# EasyEDA Pro project ProPrj_universal-fpga-expansion-board_2026-01-11.epro

# Schematic Schematic1
Board Name: Board1; Create Date: 2025-07-10; Page Name: P1; Project Name: FPGA_LAB; Schematic Name: Schematic1; Update Date: 2025-07-13; Company: EasyEDA.com; Page Size: A4; Version: V1.0
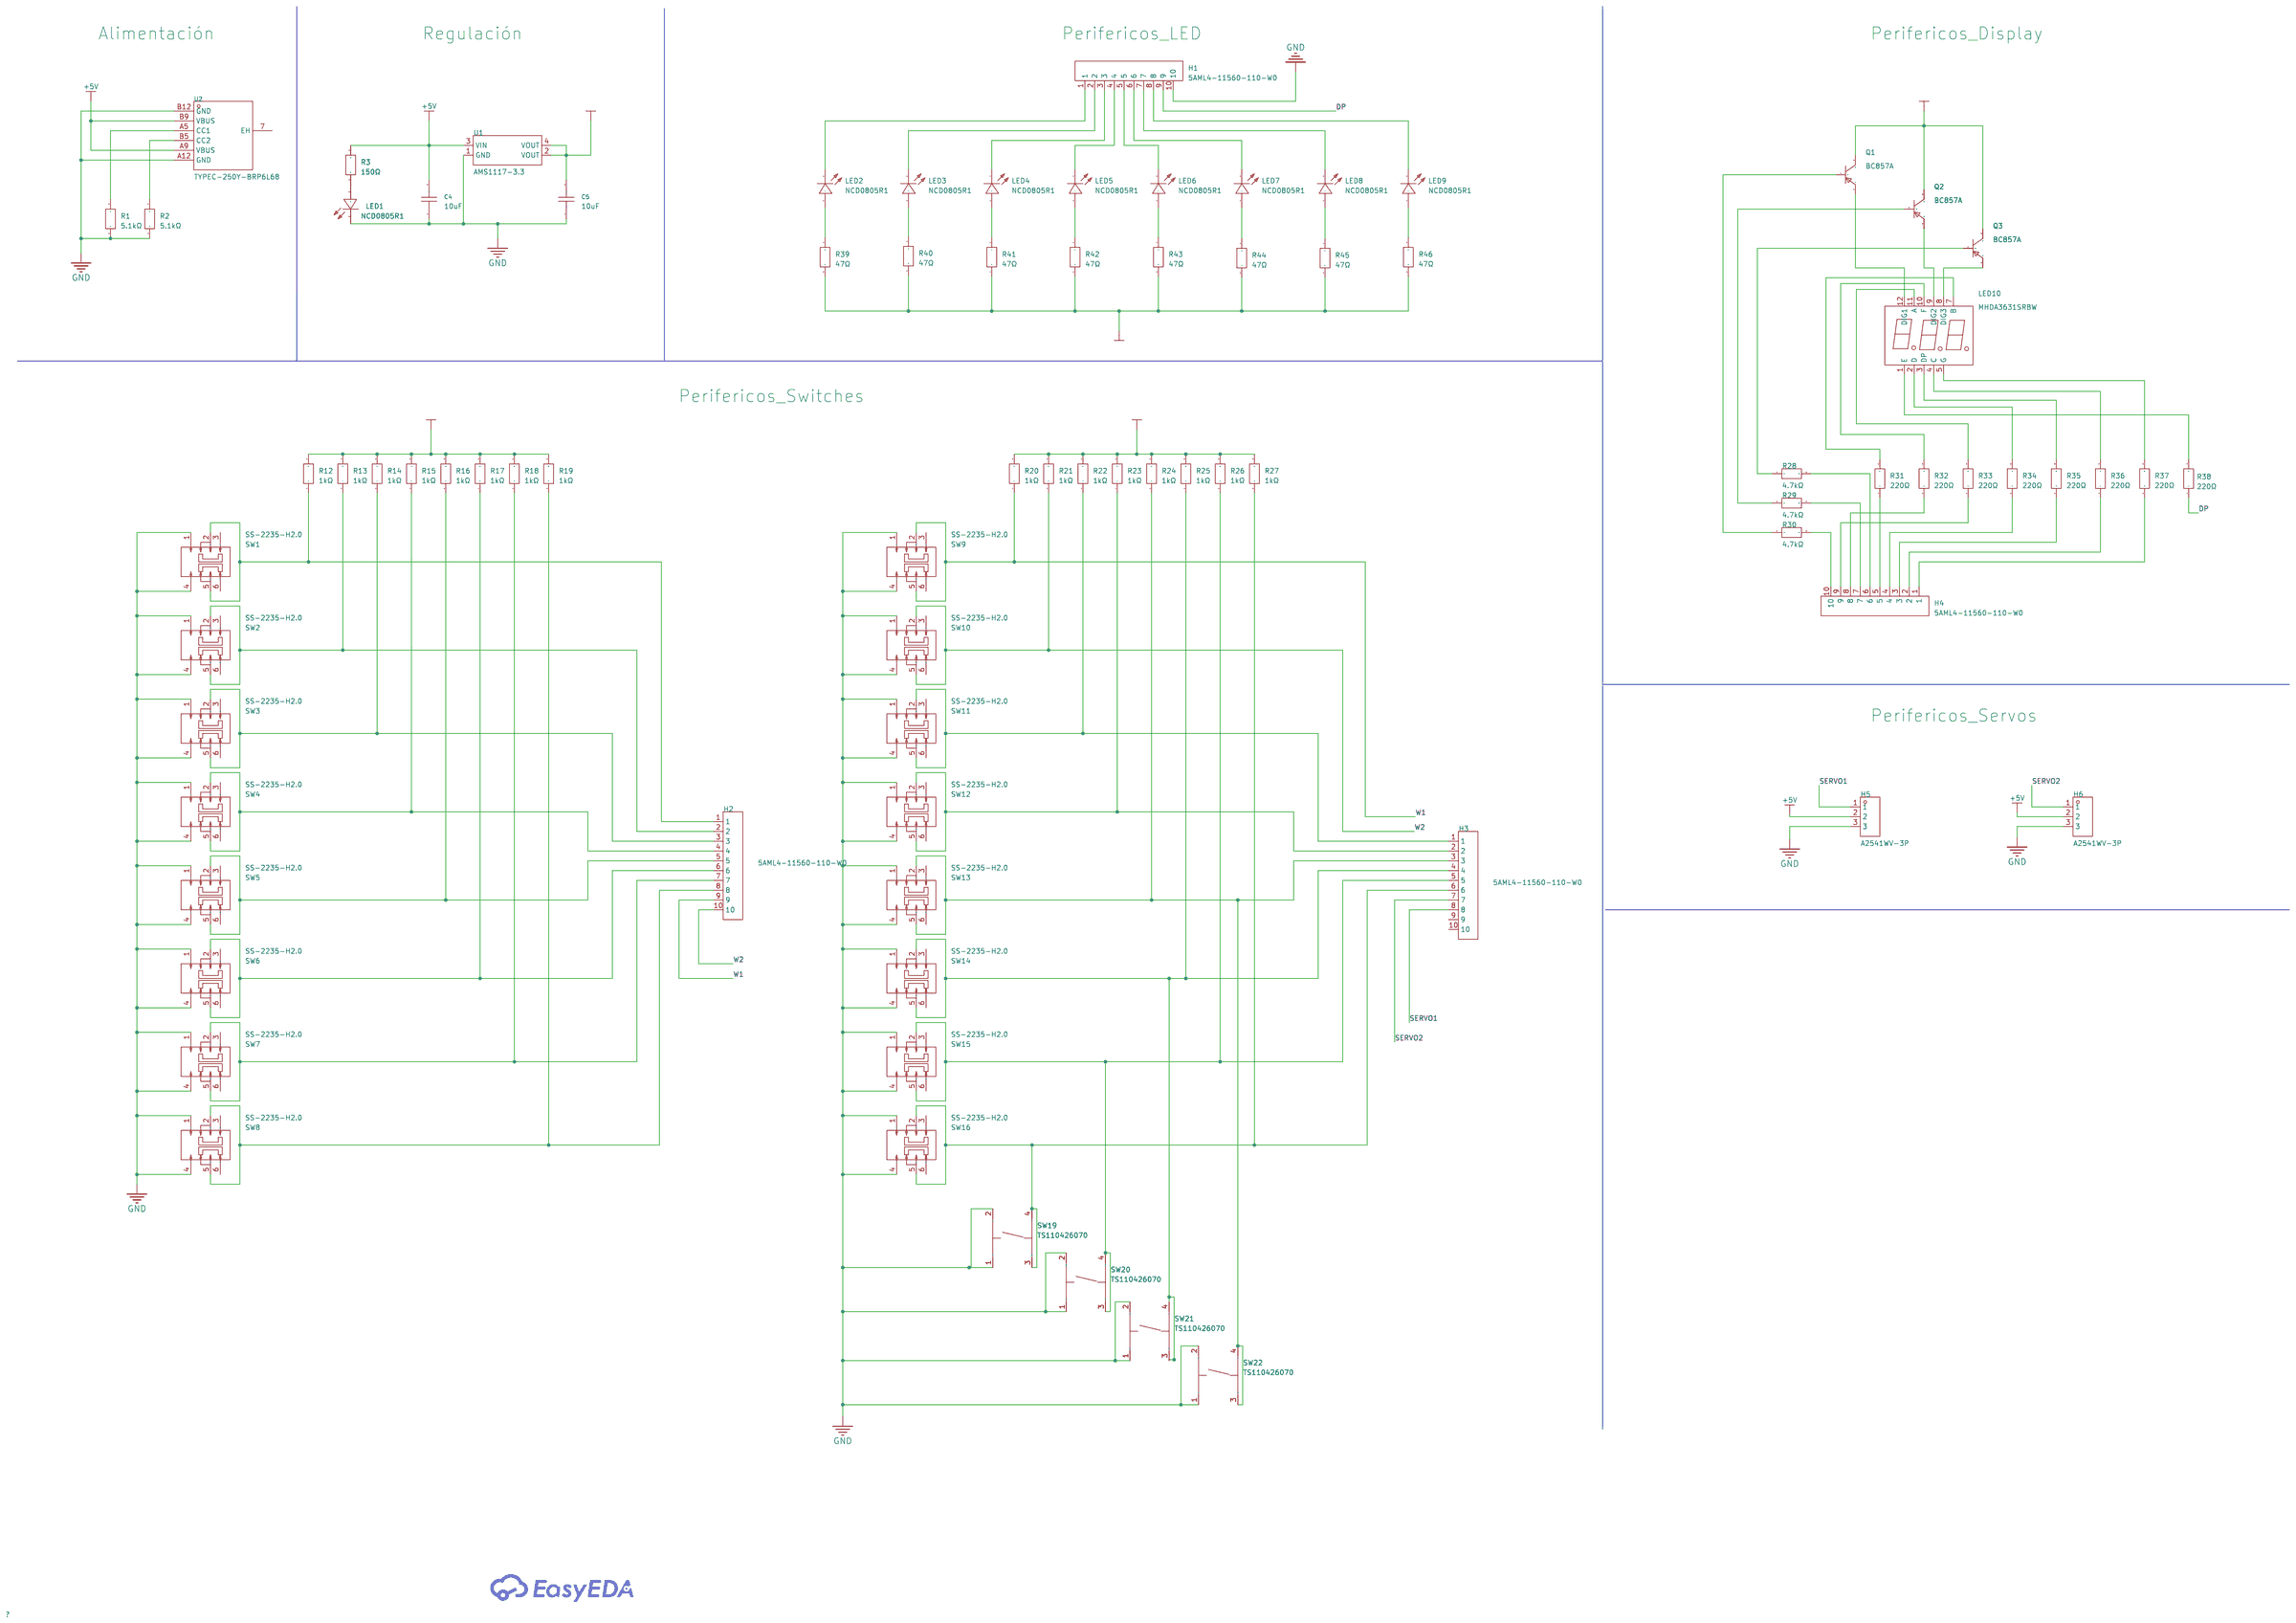
[diagram p0: schematic sheet]

## Parts
C4  10uF  [C0603]
C5  10uF  [C0603]
H1  5AML4-11560-110-W0  [HDR-TH_10P-P2.54-V-M-1]
H2  5AML4-11560-110-W0  [HDR-TH_10P-P2.54-V-M-1]
H3  5AML4-11560-110-W0  [HDR-TH_10P-P2.54-V-M-1]
H4  5AML4-11560-110-W0  [HDR-TH_10P-P2.54-V-M-1]
H5  A2541WV-3P  [HDR-TH_3P-P2.54-V-M]
H6  A2541WV-3P  [HDR-TH_3P-P2.54-V-M]
LED1  NCD0805R1  [LED0805-R-RD]
LED2  NCD0805R1  [LED0805-R-RD]
LED3  NCD0805R1  [LED0805-R-RD]
LED4  NCD0805R1  [LED0805-R-RD]
LED5  NCD0805R1  [LED0805-R-RD]
LED6  NCD0805R1  [LED0805-R-RD]
LED7  NCD0805R1  [LED0805-R-RD]
LED8  NCD0805R1  [LED0805-R-RD]
LED9  NCD0805R1  [LED0805-R-RD]
LED10  MHDA3631SRBW  [LED-SEG-TH_11P-L22.5-W14.0-P2.54-S10.18-BL]
Q1  BC857A  [SOT-23-3_L3.0-W1.7-P0.95-LS2.9-BR]
Q2  BC857A  [SOT-23-3_L3.0-W1.7-P0.95-LS2.9-BR]
Q3  BC857A  [SOT-23-3_L3.0-W1.7-P0.95-LS2.9-BR]
R1  5.1kΩ  [R1206]
R2  5.1kΩ  [R1206]
R3  150Ω  [R1206]
R12  1kΩ  [R1206]
R13  1kΩ  [R1206]
R14  1kΩ  [R1206]
R15  1kΩ  [R1206]
R16  1kΩ  [R1206]
R17  1kΩ  [R1206]
R18  1kΩ  [R1206]
R19  1kΩ  [R1206]
R20  1kΩ  [R1206]
R21  1kΩ  [R1206]
R22  1kΩ  [R1206]
R23  1kΩ  [R1206]
R24  1kΩ  [R1206]
R25  1kΩ  [R1206]
R26  1kΩ  [R1206]
R27  1kΩ  [R1206]
R28  4.7kΩ  [R1206]
R29  4.7kΩ  [R1206]
R30  4.7kΩ  [R1206]
R31  220Ω  [R1206]
R32  220Ω  [R1206]
R33  220Ω  [R1206]
R34  220Ω  [R1206]
R35  220Ω  [R1206]
R36  220Ω  [R1206]
R37  220Ω  [R1206]
R38  220Ω  [R1206]
R39  47Ω  [R1206]
R40  47Ω  [R1206]
R41  47Ω  [R1206]
R42  47Ω  [R1206]
R43  47Ω  [R1206]
R44  47Ω  [R1206]
R45  47Ω  [R1206]
R46  47Ω  [R1206]
SW1  SS-2235-H2.0  [SW-TH_6P-L9.0-W3.6-P2.50_SS-2235-H2.0]
SW2  SS-2235-H2.0  [SW-TH_6P-L9.0-W3.6-P2.50_SS-2235-H2.0]
SW3  SS-2235-H2.0  [SW-TH_6P-L9.0-W3.6-P2.50_SS-2235-H2.0]
SW4  SS-2235-H2.0  [SW-TH_6P-L9.0-W3.6-P2.50_SS-2235-H2.0]
SW5  SS-2235-H2.0  [SW-TH_6P-L9.0-W3.6-P2.50_SS-2235-H2.0]
SW6  SS-2235-H2.0  [SW-TH_6P-L9.0-W3.6-P2.50_SS-2235-H2.0]
SW7  SS-2235-H2.0  [SW-TH_6P-L9.0-W3.6-P2.50_SS-2235-H2.0]
SW8  SS-2235-H2.0  [SW-TH_6P-L9.0-W3.6-P2.50_SS-2235-H2.0]
SW9  SS-2235-H2.0  [SW-TH_6P-L9.0-W3.6-P2.50_SS-2235-H2.0]
SW10  SS-2235-H2.0  [SW-TH_6P-L9.0-W3.6-P2.50_SS-2235-H2.0]
SW11  SS-2235-H2.0  [SW-TH_6P-L9.0-W3.6-P2.50_SS-2235-H2.0]
SW12  SS-2235-H2.0  [SW-TH_6P-L9.0-W3.6-P2.50_SS-2235-H2.0]
SW13  SS-2235-H2.0  [SW-TH_6P-L9.0-W3.6-P2.50_SS-2235-H2.0]
SW14  SS-2235-H2.0  [SW-TH_6P-L9.0-W3.6-P2.50_SS-2235-H2.0]
SW15  SS-2235-H2.0  [SW-TH_6P-L9.0-W3.6-P2.50_SS-2235-H2.0]
SW16  SS-2235-H2.0  [SW-TH_6P-L9.0-W3.6-P2.50_SS-2235-H2.0]
SW19  TS110426070  [SW-SMD_TS110426070]
SW20  TS110426070  [SW-SMD_TS110426070]
SW21  TS110426070  [SW-SMD_TS110426070]
SW22  TS110426070  [SW-SMD_TS110426070]
U1  AMS1117-3.3  [SOT-223-3_L6.7-W3.7-P2.30-LS7.0-BR]
U2  TYPEC-250Y-BRP6L68  [TYPE-C-SMD_XUNPU_TYPEC-250Y-BRP6L68]

## Library data of the parts
C4 C5 = CL10A106MQ8NNNC: Capacitance: Tolerance:±20% Tolerance:±20% Voltage Rated: Temperature Coefficient:; LCSC Part Name: 10uF ±20% 6.3V; Supplier Part: C1691; Manufacturer: SAMSUNG(三星); Supplier Footprint: 0603; JLCPCB Part Class: Extended Part; Datasheet: https://atta.szlcsc.com/upload/public/pdf/source/20160218/1457707763339.pdf; Supplier: LCSC; Tolerance: ±20%
H1-H4 = 5AML4-11560-110-W0: Pin Structure:1x10P Pitch:2.54mm Row Spacing:- Circluar Pins/Square Pins:Pin Header Mounting Type:Through Hole Number of Rows:1 Number of Pins:10P Current Rating:3A Voltage Rating (Max):- Length of Mating Pin:6mm Insulation Height:2.5mm Length of End Conn; LCSC Part Name: 1x10P 间距:2.54mm 方针 直插; Supplier Part: C41374240; Manufacturer: SAMZO(三佐); Supplier Footprint: 插件,P=2.54mm; Datasheet: https://atta.szlcsc.com/upload/public/pdf/source/20240717/E6C59586925ABF058B406B6757A67FC7.pdf; Supplier: LCSC; Pin Structure: 1x10P; Pitch: 2.54mm; Circluar Pins/Square Pins: Pin Header; Mounting Type: Through Hole; Number of Rows: 1; Number of Pins: 10P; Current Rating: 3A; Length of Mating Pin: 6mm; Insulation Height: 2.5mm; Length of End Connection Pin: 3mm; Contact Material: Brass; Contact Plating: Gold; Operating Temperature: -40℃~+105℃; Color: Black
H5 H6 = A2541WV-3P_C5445396: Pin Structure:1x3P Pitch:2.54mm Row Spacing:- Circluar Pins/Square Pins:Policy Mounting Type:Straight Number of Rows:Single Row Number of Pins:3P Current Rating:3A Voltage Rating (Max):250V Length of Mating Pin:6mm Insulation Height:2.54mm Length of End C; LCSC Part Name: 1x3P 间距:2.54mm 方针 直插; Supplier Part: C5445396; Manufacturer: CJT(长江连接器); Supplier Footprint: 插件,P=2.54mm; JLCPCB Part Class: Extended Part; Datasheet: https://atta.szlcsc.com/upload/public/pdf/source/20190522/C339348_148DC62DFEE35B66DE27661541078F4A.pdf; Supplier: LCSC; Pin Structure: 1x3P; Pitch: 2.54mm; Circluar Pins/Square Pins: Policy; Mounting Type: Straight; Number of Rows: Single Row; Number of Pins: 3P; Current Rating: 3A; Voltage Rating (Max): 250V; Length of Mating Pin: 6mm; Insulation Height: 2.54mm; Length of End Connection Pin: 3mm; Contact Material: Brass; Contact Plating: Gold; Operating Temperature: -40℃~+105℃; Color: Black
LED1-LED9 = NCD0805R1_C84256: Lamp Holder Type:- Emitted Color:Red Forward Voltage (VF):1.6V~2.6V Forward Voltage (VF):1.6V~2.6V Power Dissipation:65mW Forward Current:20mA Dominant Wavelength:615nm~630nm Dominant Wavelength:615nm~630nm Peak Wavelength:- Diode Configuration:独立二极管 Lens; Supplier Part: C84256; Manufacturer: 国星光电; Supplier Footprint: 0805; JLCPCB Part Class: Basic Part; Datasheet: https://atta.szlcsc.com/upload/public/pdf/source/20200820/C84256_F0A75A43B3EAD75808600A0514C76B99.pdf; Supplier: LCSC; Emitted Color: Red; Forward Voltage (VF): 1.6V~2.6V; Power Dissipation: 65mW; Forward Current: 20mA; Dominant Wavelength: 615nm~630nm; Diode Configuration: 独立二极管; Lens Color: 无色透明透镜; Luminous Intensity: 67mcd~195mcd; Viewing Angle: 130°; Operating Temperature: -30℃~+85℃
LED10 = MHDA3631SRBW: Number of Characters:3Bit Module Size:22.5mmx14mmx7.2mm Power Dissipation:50mW Luminous Color:Red LED Polarity:共阳极 Digit/Alpha Size(inch):0.362; LCSC Part Name: 0.36直插数码管共阳三八红色光; Supplier Part: C401123; Manufacturer: MEIHUA(美华); Supplier Footprint: 插件; JLCPCB Part Class: Extended Part; Datasheet: https://atta.szlcsc.com/upload/public/pdf/source/20190702/C401123_23F92DF2081D881E25360757DABBD4C8.pdf; Supplier: LCSC; Number of Characters: 3Bit; Module Size: 22.5mmx14mmx7.2mm; Power Dissipation: 50mW; Luminous Color: Red; LED Polarity: 共阳极; Digit/Alpha Size(inch): 0.362
Q1-Q3 = BC857A_1: Supplier Part: C19626403; Manufacturer: YFW(佑风微); Supplier Footprint: SOT-23; JLCPCB Part Class: Extended Part; Datasheet: https://atta.szlcsc.com/upload/public/pdf/source/20231208/71E5B256E3A60A36DE87C30A129C1C7C.pdf; Supplier: LCSC
R1 R2 = FRC1206J512 TS: Type:Thick Film Resistors Resistance:5.1kΩ Tolerance:±5% Tolerance:±5% Power(Watts):0.25W Voltage-Supply(Max):200V Temperature Coefficient:±100ppm/℃ Temperature Coefficient:±100ppm/℃ Operating Temperature:-55℃~+155℃ Operating Temperature:-55℃~+155℃; LCSC Part Name: 5.1kΩ ±5% 250mW 厚膜电阻; Supplier Part: C2907509; Manufacturer: FOJAN(富捷); Supplier Footprint: 1206; JLCPCB Part Class: Extended Part; Datasheet: https://atta.szlcsc.com/upload/public/pdf/source/20211221/925EC7D7225764EE0046F22065062C87.pdf; Supplier: LCSC; Type: Thick Film Resistors; Tolerance: ±5%; Power(Watts): 0.25W; Voltage-Supply(Max): 200V; Temperature Coefficient: ±100ppm/℃; Operating Temperature: -55℃~+155℃
R3 = SC1206J1500F8ANRH: Resistance:150Ω Tolerance:±5% Tolerance:±5% Power(Watts):- Temperature Coefficient:±100ppm/℃ Temperature Coefficient:±100ppm/℃; LCSC Part Name: 150Ω ±5%; Supplier Part: C3152296; Manufacturer: Sunway(信维通信); Supplier Footprint: 1206; JLCPCB Part Class: Extended Part; Datasheet: https://atta.szlcsc.com/upload/public/pdf/source/20220728/FFCE43BB6DF8FA16AEE331F0F4B289DE.pdf; Supplier: LCSC; Tolerance: ±5%; Temperature Coefficient: ±100ppm/℃
R12-R27 = AF1206FR-071KL: Type:Thick Film Resistor Resistance:1kΩ Tolerance:±1% Tolerance:±1% Power(Watts):250mW Temperature Coefficient:±100ppm/℃ Temperature Coefficient:±100ppm/℃ Operating Temperature:-55℃~+155℃ Operating Temperature:-55℃~+155℃; LCSC Part Name: 厚膜电阻 1kΩ ±1% 250mW; Supplier Part: C855120; Manufacturer: YAGEO(国巨); Supplier Footprint: 1206; JLCPCB Part Class: Extended Part; Datasheet: https://atta.szlcsc.com/upload/public/pdf/source/20250609/E0B9E6D1974B6D3093733BC54323BE0E.pdf; Supplier: LCSC; Type: Thick Film Resistor; Tolerance: ±1%; Power(Watts): 250mW; Temperature Coefficient: ±100ppm/℃; Operating Temperature: -55℃~+155℃
R28-R30 = FRC1206F4701TS: Type:Thick Film Resistors Resistance:4.7kΩ Tolerance:±1% Tolerance:±1% Power(Watts):0.25W Voltage-Supply(Max):200V Temperature Coefficient:±100ppm/℃ Temperature Coefficient:±100ppm/℃ Operating Temperature:-55℃~+155℃ Operating Temperature:-55℃~+155℃; LCSC Part Name: 4.7kΩ ±1% 250mW 厚膜电阻; Supplier Part: C2907387; Manufacturer: FOJAN(富捷); Supplier Footprint: 1206; JLCPCB Part Class: Extended Part; Datasheet: https://atta.szlcsc.com/upload/public/pdf/source/20211221/925EC7D7225764EE0046F22065062C87.pdf; Supplier: LCSC; Type: Thick Film Resistors; Tolerance: ±1%; Power(Watts): 0.25W; Voltage-Supply(Max): 200V; Temperature Coefficient: ±100ppm/℃; Operating Temperature: -55℃~+155℃
R31-R38 = RT1206BRD07220RL: Type:Thin Film Resistor Resistance: Tolerance:±0.1% Tolerance:±0.1% Power(Watts):250mW Temperature Coefficient:±25ppm/℃ Temperature Coefficient:±25ppm/℃ Operating Temperature Range:-55℃~+155℃ Operating Temperature Range:-55℃~+155℃; LCSC Part Name: 薄膜电阻 220Ω ±0.1% 250mW; Supplier Part: C870551; Manufacturer: YAGEO(国巨); Supplier Footprint: 1206; JLCPCB Part Class: Extended Part; Datasheet: https://atta.szlcsc.com/upload/public/pdf/source/20200610/C326738_5639A9F1B6EB6E4AE2197577D3456E7F.pdf; Supplier: LCSC; Type: Thin Film Resistor; Tolerance: ±0.1%; Power(Watts): 250mW; Temperature Coefficient: ±25ppm/℃; Operating Temperature Range: -55℃~+155℃
R39-R46 = FRC1206J470 TS: Type:Thick Film Resistors Resistance:47Ω Tolerance:±5% Tolerance:±5% Power(Watts):250mW Voltage-Supply(Max):200V Temperature Coefficient:±100ppm/℃ Temperature Coefficient:±100ppm/℃ Operating Temperature:-55℃~+155℃ Operating Temperature:-55℃~+155℃; LCSC Part Name: 47Ω ±5% 250mW 厚膜电阻; Supplier Part: C2907508; Manufacturer: FOJAN(富捷); Supplier Footprint: 1206; JLCPCB Part Class: Extended Part; Datasheet: https://atta.szlcsc.com/upload/public/pdf/source/20211221/925EC7D7225764EE0046F22065062C87.pdf; Supplier: LCSC; Type: Thick Film Resistors; Tolerance: ±5%; Power(Watts): 250mW; Voltage-Supply(Max): 200V; Temperature Coefficient: ±100ppm/℃; Operating Temperature: -55℃~+155℃
SW1-SW16 = SS-2235-H2.0: Circuit:Single Pole Double Throw (SPDT) Actuator Style:Rectangular column Mounting Style:Direct Insert Current Rating (DC):100mA Voltage Rating (DC):12V Mechanical Life:10000 times; LCSC Part Name: 两档立式插件 6脚拨动 柄长2.0MM; Supplier Part: C7501621; Manufacturer: XUNPU(讯普); Supplier Footprint: DIP; JLCPCB Part Class: Extended Part; Datasheet: https://atta.szlcsc.com/upload/public/pdf/source/20230815/9CB9F910C400F110CE554E4E2D8A5C4E.pdf; Supplier: LCSC; Circuit: Single Pole Double Throw (SPDT); Actuator Style: Rectangular column; Mounting Style: Direct Insert; Current Rating (DC): 100mA; Voltage Rating (DC): 12V; Mechanical Life: 10000 times
SW19-SW22 = TS110426070: Circuit:SPST Actuator Style:Round Button Operating Force:2.6N Switch Height:7mm; Supplier Part: C22375333; Manufacturer: HanElectricity(瀚源); Supplier Footprint: SMD-4P,6x6mm; JLCPCB Part Class: Extended Part; Datasheet: https://atta.szlcsc.com/upload/public/pdf/source/20240426/F3DF38674F71AF10B9DA4A244CA2066F.pdf; Supplier: LCSC; Circuit: SPST; Actuator Style: Round Button; Operating Force: 2.6N; Switch Height: 7mm
U1 = AMS1117-3.3_C18164485: Output Type:Fixed Maximum Input Voltage:15V Output Voltage:3.3V Output Voltage:3.3V Output Current:1A Power Supply Rejection Ratio (PSRR):75dB@(120Hz) Dropout Voltage:1.2V@(1A) standby current:5mA Feature:Thermal Protection(TSD)；Overcurrent Protection(OCP; Supplier Part: C18164485; Manufacturer: GR(国睿); Supplier Footprint: SOT-223; JLCPCB Part Class: Extended Part; Datasheet: https://atta.szlcsc.com/upload/public/pdf/source/20230915/94CBA0DE456537EBE1AFE762E38F0E43.pdf; Supplier: LCSC; Output Type: Fixed; Maximum Input Voltage: 15V; Output Voltage: 3.3V; Output Current: 1A; Power Supply Rejection Ratio (PSRR): 75dB@(120Hz); Dropout Voltage: 1.2V@(1A); standby current: 5mA; Feature: Thermal Protection(TSD)；Overcurrent Protection(OCP); Output Polarity: Positive electrode; Number of Outputs: 1
U2 = TYPEC-250Y-BRP6L68: Connector Type:Type-C Gender:Female; LCSC Part Name: Type-C 母; Supplier Part: C5252714; Manufacturer: XUNPU(讯普); Supplier Footprint: SMD; JLCPCB Part Class: Extended Part; Datasheet: https://atta.szlcsc.com/upload/public/pdf/source/20221110/D866B449E7E05D725FFD0DA4DBD418D3.pdf; Supplier: LCSC; Connector Type: Type-C; Gender: Female

## Nets
+3.3V: C5.2 Q1.3(C) Q2.3(C) Q3.3(C) R12.2 R13.2 R14.2 R15.2 R16.2 R17.2 R18.2 R19.2 R20.2 R21.2 R22.2 R23.2 R24.2 R25.2 R26.2 R27.2 R39.2 R40.2 R41.2 R42.2 R43.2 R44.2 R45.2 R46.2 U1.2(VOUT) U1.4(VOUT)
+5V: C4.2 H5.2 H6.2 R3.2 U1.3(VIN) U2.A9(VBUS) U2.B9(VBUS)
GND: C4.1 C5.1 H1.10 H5.3 H6.3 LED1.2(-) R1.1 R2.1 SW1.1 SW1.4 SW2.1 SW2.4 SW3.1 SW3.4 SW4.1 SW4.4 SW5.1 SW5.4 SW6.1 SW6.4 SW7.1 SW7.4 SW8.1 SW8.4 SW9.1 SW9.4 SW10.1 SW10.4 SW11.1 SW11.4 SW12.1 SW12.4 SW13.1 SW13.4 SW14.1 SW14.4 SW15.1 SW15.4 SW16.1 SW16.4 SW19.1 SW19.2 SW20.1 SW20.2 SW21.1 SW21.2 SW22.1 SW22.2 U1.1(GND) U2.A12(GND) U2.B12(GND)
DP: H1.9 R38.1
SERVO1: H3.8 H5.1
SERVO2: H3.7 H6.1
W1: H2.9 R20.1 SW9.2 SW9.5
W2: H2.10 R21.1 SW10.2 SW10.5
$1N489: R1.2 U2.A5(CC1)
$1N494: R2.2 U2.B5(CC2)
$1N1457: LED1.1(+) R3.1
$1N2239: LED2.1(+) R39.1
$1N2499: LED4.1(+) R41.1
$1N2504: LED5.1(+) R42.1
$1N2509: LED6.1(+) R43.1
$1N2522: LED7.1(+) R44.1
$1N2526: LED8.1(+) R45.1
$1N2531: LED9.1(+) R46.1
$1N2539: H1.1 LED2.2(-)
$1N2545: H1.2 LED3.2(-)
$1N2552: H1.3 LED4.2(-)
$1N2568: H1.4 LED5.2(-)
$1N2577: H1.5 LED6.2(-)
$1N2586: H1.6 LED7.2(-)
$1N2592: H1.7 LED8.2(-)
$1N2600: H1.8 LED9.2(-)
$1N3515: H2.1 R12.1 SW1.2 SW1.5
$1N3939: H2.2 R13.1 SW2.2 SW2.5
$1N3994: H2.3 R14.1 SW3.2 SW3.5
$1N4049: H2.4 R15.1 SW4.2 SW4.5
$1N4294: H2.6 R17.1 SW6.2 SW6.5
$1N4304: H2.5 R16.1 SW5.2 SW5.5
$1N4310: H2.7 R18.1 SW7.2 SW7.5
$1N4316: H2.8 R19.1 SW8.2 SW8.5
$1N5605: H3.2 R23.1 SW12.2 SW12.5
$1N5629: H3.1 R22.1 SW11.2 SW11.5
$1N6803: Q1.1(B) R30.1
$1N6820: Q2.1(B) R29.1
$1N6826: Q3.1(B) R28.1
$1N6838: LED10.12(DIG1) Q1.2(E)
$1N6844: LED10.9(DIG2) Q2.2(E)
$1N6850: LED10.8(DIG3) Q3.2(E)
$1N6855: H4.10 R30.2
$1N6860: H4.7 R29.2
$1N6868: H4.6 R28.2
$1N6873: H4.5 R31.1
$1N6882: H4.8 R32.1
$1N6894: H4.4 R34.1
$1N6900: H4.3 R35.1
$1N6943: H4.2 R36.1
$1N7039: H4.1 R37.1
$1N8645: LED10.5(G) R37.2
$1N8653: LED10.7(B) R31.2
$1N8661: LED10.10(F) R32.2
$1N8736: LED10.11(A) R33.2
$1N8986: LED10.1(E) R38.2
$1N9010: LED10.2(D) R34.2
$1N9014: LED10.3(DP) R35.2
$1N9048: LED10.4(C) R36.2
$1N9241: H3.6 R27.1 SW16.2 SW16.5 SW19.3 SW19.4
$1N9260: H3.5 R26.1 SW15.2 SW15.5 SW20.3 SW20.4
$1N9265: H3.4 R25.1 SW14.2 SW14.5 SW21.3 SW21.4
$1N9299: H3.3 R24.1 SW13.2 SW13.5 SW22.3 SW22.4
$1N11687: H4.9 R33.1
$1N12459: LED3.1(+) R40.1

Not connected (* = marked no-connect by the designer): H3 9 10; SW1 3 6; SW2 3 6; SW3 3 6; SW4 3 6; SW5 3 6; SW6 3 6; SW7 3 6; SW8 3 6; SW9 3 6; SW10 3 6; SW11 3 6; SW12 3 6; SW13 3 6; SW14 3 6; SW15 3 6; SW16 3 6; U2 7(EH)

## Notes on the sheet
- Alimentación
- Regulación
- Perifericos_LED
- Perifericos_Display
- Perifericos_Switches
- Perifericos_Servos

# Board PCB1
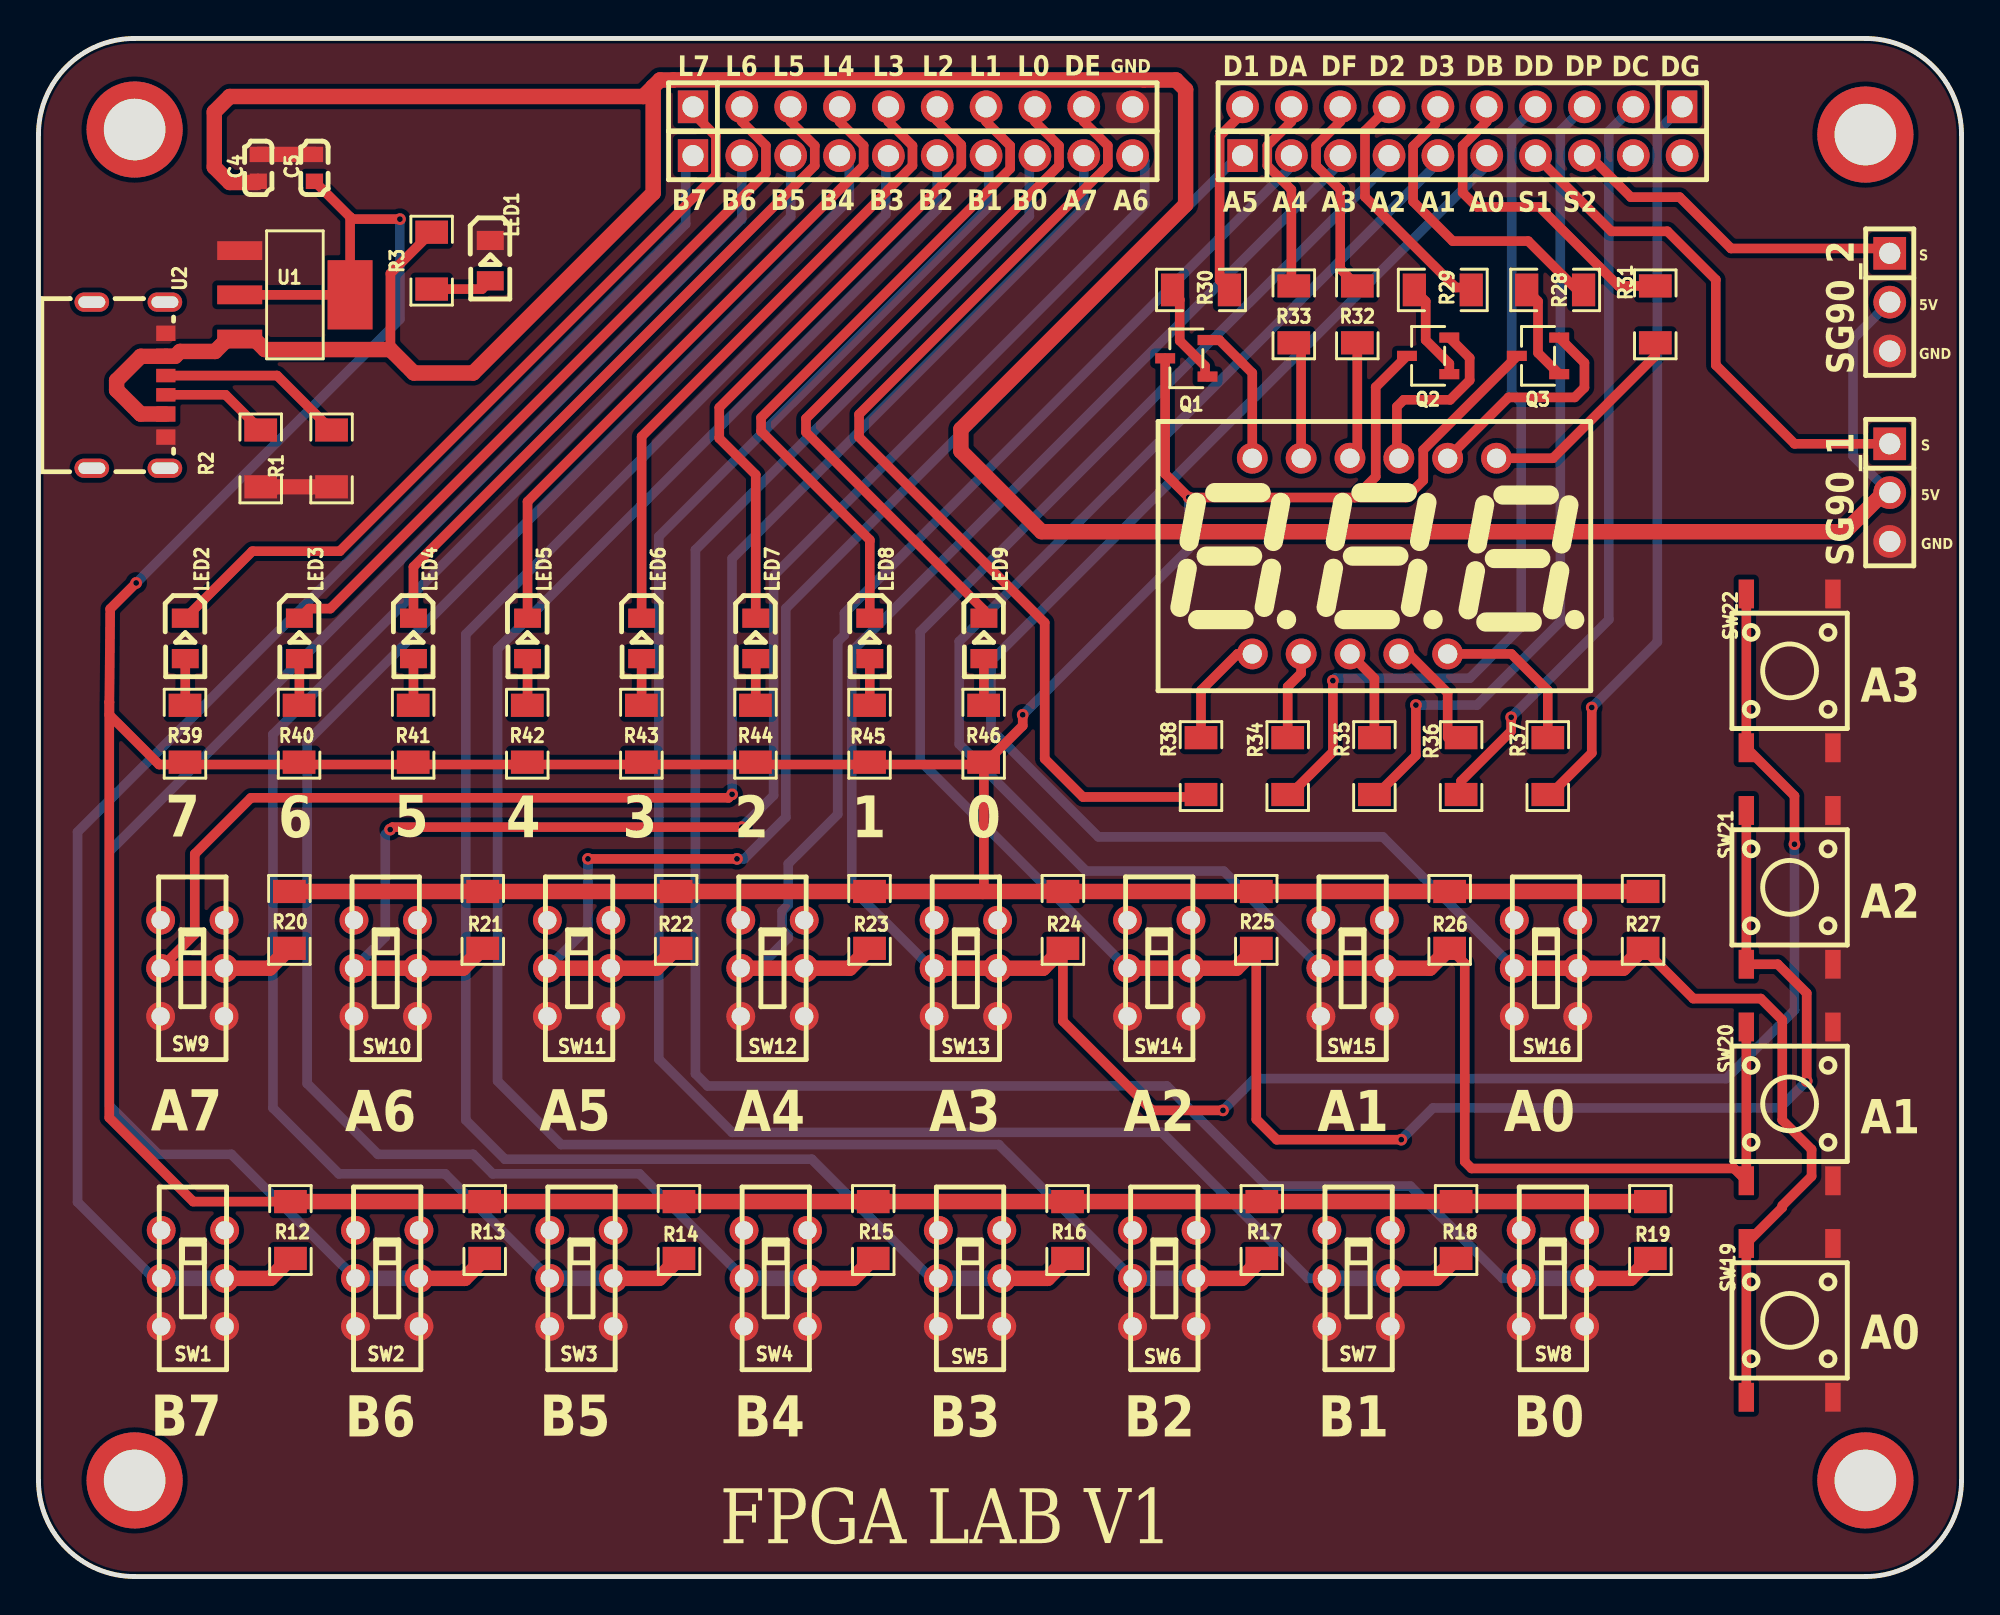
[diagram p1: board, top side]
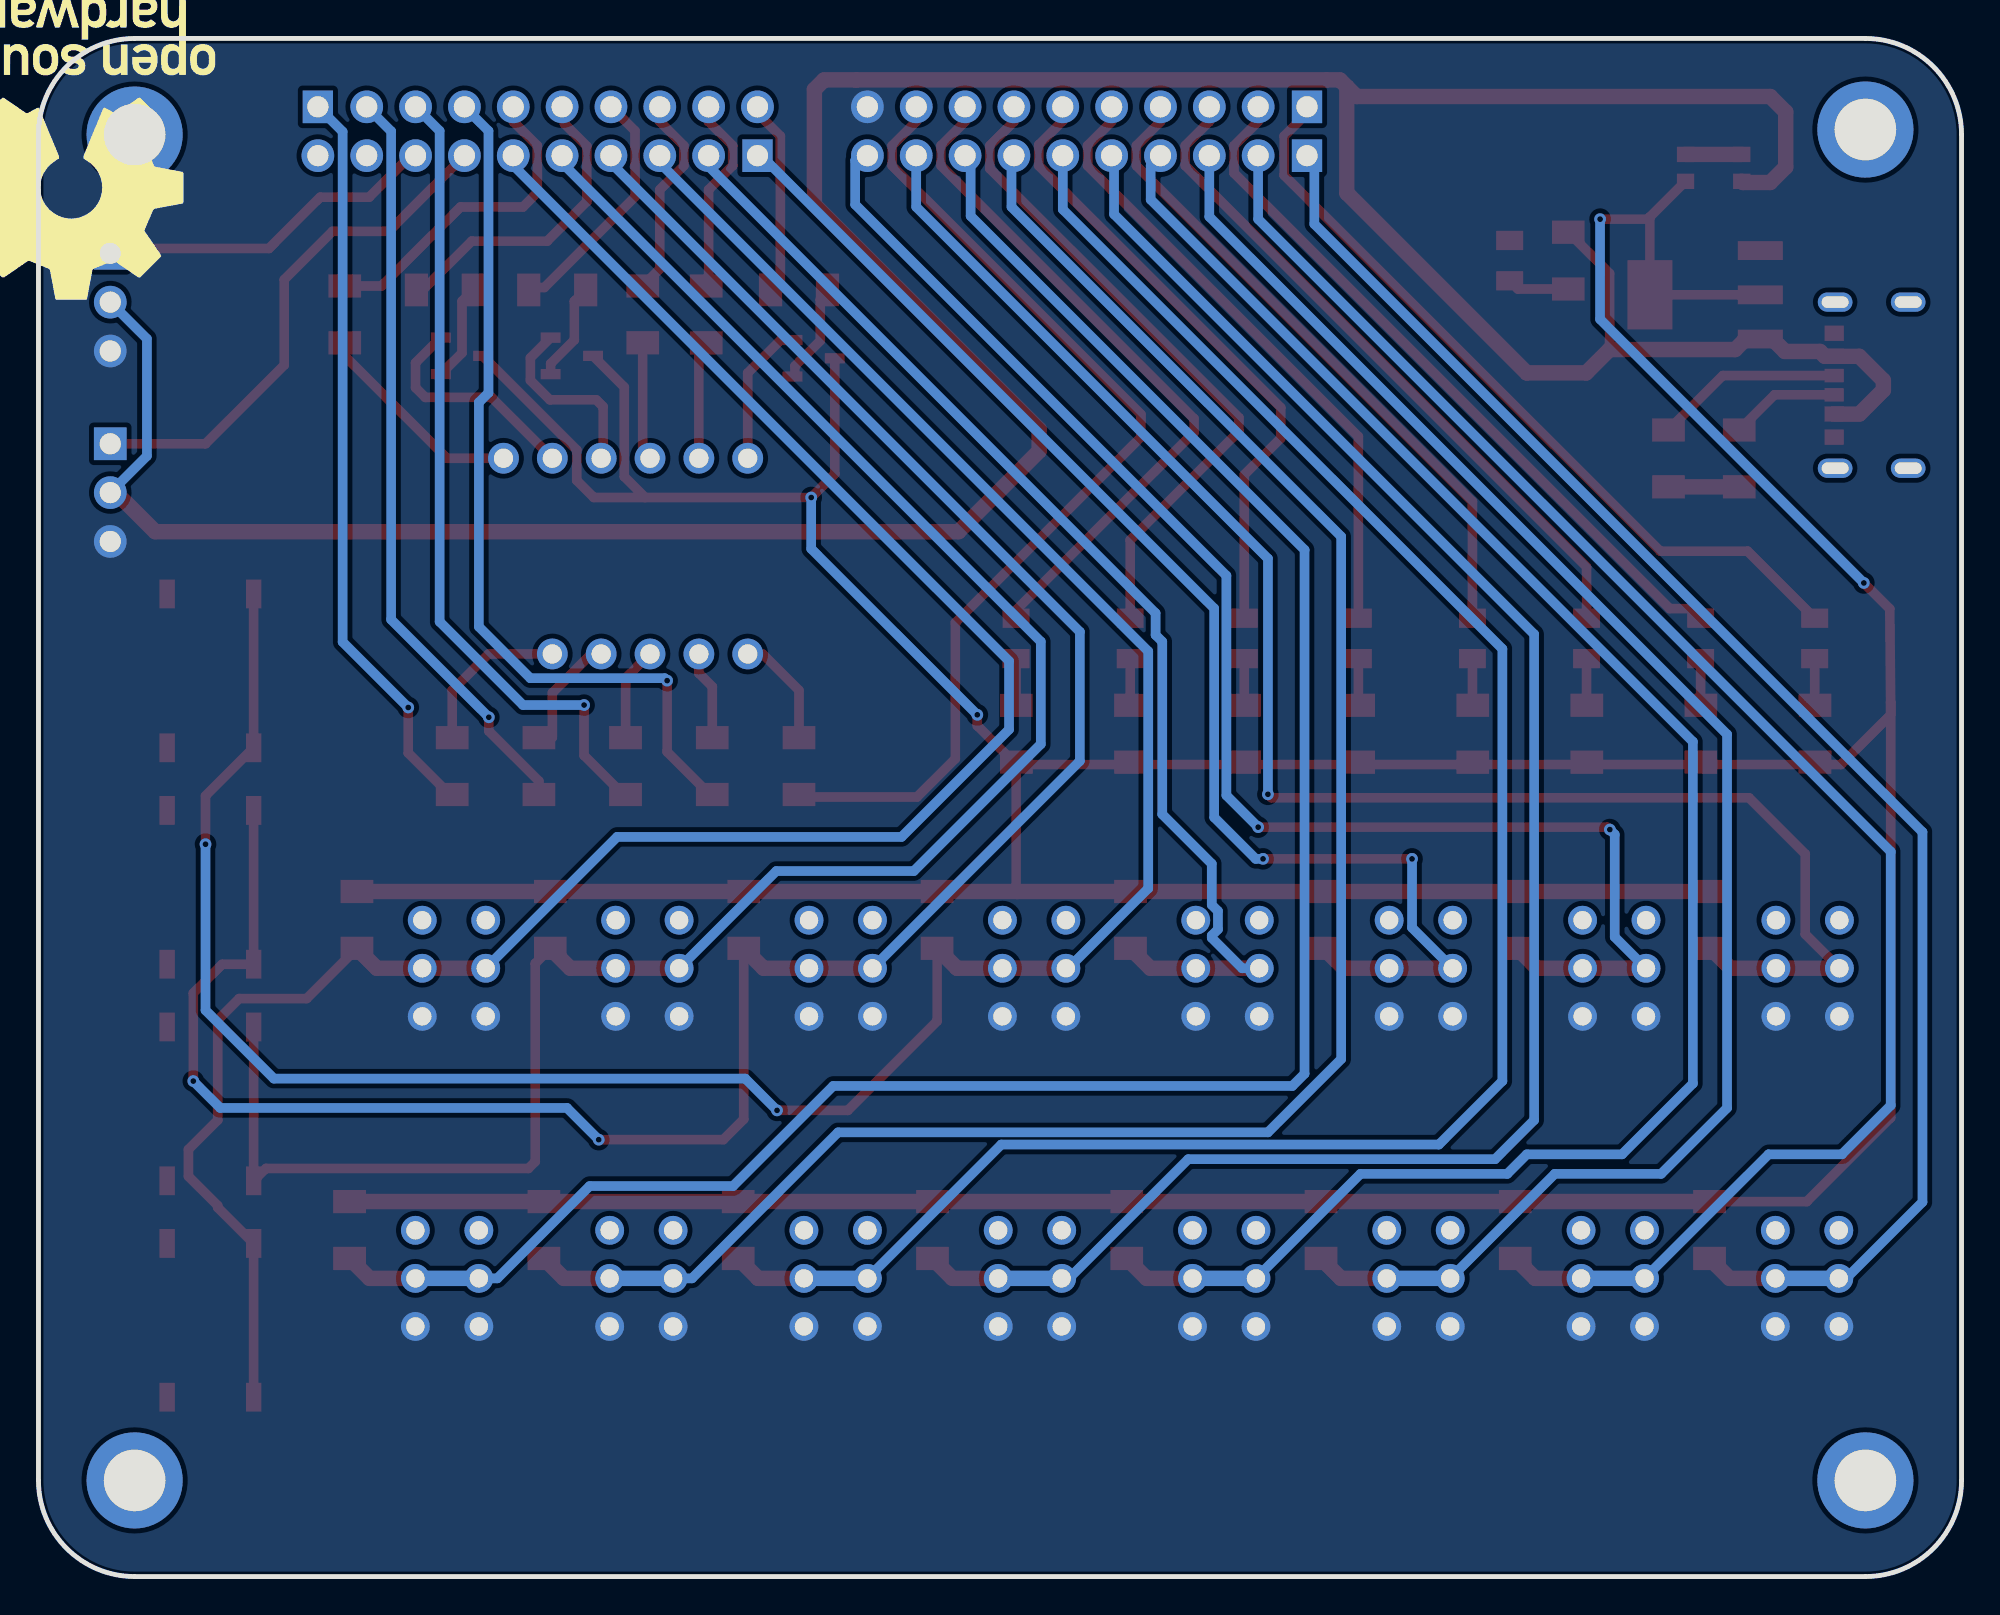
[diagram p2: board, bottom side, seen from below]

Outline 100 x 80 mm; copper layers: Top Layer, Bottom Layer. Coordinates in mm from the lower left corner of the outline.
Outline path: 0,75 0,5 arc(1.46,1.46) 5,0 95,0 arc(98.54,1.46) 100,5 100,75 arc(98.54,78.53) 95,80 5,80 arc(1.46,78.54) 0,75
Stack: Top Layer 0.035mm / Dielectric1 1.51mm FR4 er 4.5 / Bottom Layer 0.035mm

## Design rules (mm)
template: Custom Config
spacing copperThickness1oz (default): track to track 0.102, other pairs 0.152 to 0.3
spacing copperThickness2oz: track to track 0.203, other pairs 0.152 to 0.3
track width copperThickness1oz (default): min 0.2, default 0.5, max 2.54
track width copperThickness2oz: min 0.203, default 0.254, max 2.54
differential pair differentialPair (default): width min 0.127, default 0.254, max 2.54; gap min 0.152, default 0.152
via viaSize (default): diameter min 0.5, default 0.61, max 10; hole min 0.3, default 0.305, max 6.3

## Placement (name value [footprint] x y rotation side)
C4  10uF  [C0603]  11.43 73.27 270 top
C5  10uF  [C0603]  14.35 73.27 270 top
H1  5AML4-11560-110-W0  [HDR-TH_10P-P2.54-V-M-1]  45.47 76.44 0 top
H2  5AML4-11560-110-W0  [HDR-TH_10P-P2.54-V-M-1]  45.47 73.9 0 top
H3  5AML4-11560-110-W0  [HDR-TH_10P-P2.54-V-M-1]  74.04 73.9 0 top
H4  5AML4-11560-110-W0  [HDR-TH_10P-P2.54-V-M-1]  74.04 76.44 180 top
H5  A2541WV-3P  [HDR-TH_3P-P2.54-V-M]  96.27 66.28 270 top
H6  A2541WV-3P  [HDR-TH_3P-P2.54-V-M]  96.27 56.38 270 top
LED1  NCD0805R1  [LED0805-R-RD]  23.5 68.44 270 top
LED2  NCD0805R1  [LED0805-R-RD]  7.63 48.79 270 top
LED3  NCD0805R1  [LED0805-R-RD]  13.57 48.79 270 top
LED4  NCD0805R1  [LED0805-R-RD]  19.5 48.79 270 top
LED5  NCD0805R1  [LED0805-R-RD]  25.43 48.79 270 top
LED6  NCD0805R1  [LED0805-R-RD]  31.37 48.79 270 top
LED7  NCD0805R1  [LED0805-R-RD]  37.3 48.79 270 top
LED8  NCD0805R1  [LED0805-R-RD]  43.23 48.79 270 top
LED9  NCD0805R1  [LED0805-R-RD]  49.16 48.79 270 top
LED10  MHDA3631SRBW  [LED-SEG-TH_11P-L22.5-W14.0-P2.54-S10.18-BL]  69.47 53.08 0 top
NOREF  -  [Pad_e132]  95 75 0 top
NOREF#2  -  [Pad_e130]  5 75.26 0 top
NOREF#3  -  [Pad_e133]  95 5 0 top
NOREF#4  -  [Pad_e134]  5 5 0 top
Q1  BC857A  [SOT-23-3_L3.0-W1.7-P0.95-LS2.9-BR]  59.69 63.36 0 top
Q2  BC857A  [SOT-23-3_L3.0-W1.7-P0.95-LS2.9-BR]  72.26 63.49 0 top
Q3  BC857A  [SOT-23-3_L3.0-W1.7-P0.95-LS2.9-BR]  77.98 63.49 0 top
R1  5.1kΩ  [R1206]  15.24 58.16 90 top
R2  5.1kΩ  [R1206]  11.56 58.16 90 top
R3  150Ω  [R1206]  20.45 68.44 90 top
R12  1kΩ  [R1206]  13.1 18.02 90 top
R13  1kΩ  [R1206]  23.2 18.02 90 top
R14  1kΩ  [R1206]  33.31 18.02 90 top
R15  1kΩ  [R1206]  43.41 18.02 90 top
R16  1kΩ  [R1206]  53.51 18.02 90 top
R17  1kΩ  [R1206]  63.61 18.02 90 top
R18  1kΩ  [R1206]  73.72 18.02 90 top
R19  1kΩ  [R1206]  83.82 18.02 90 top
R20  1kΩ  [R1206]  13.05 34.15 90 top
R21  1kΩ  [R1206]  23.1 34.15 90 top
R22  1kΩ  [R1206]  33.16 34.15 90 top
R23  1kΩ  [R1206]  43.22 34.15 90 top
R24  1kΩ  [R1206]  53.27 34.15 90 top
R25  1kΩ  [R1206]  63.33 34.15 90 top
R26  1kΩ  [R1206]  73.38 34.15 90 top
R27  1kΩ  [R1206]  83.44 34.15 90 top
R28  4.7kΩ  [R1206]  78.87 66.92 0 top
R29  4.7kΩ  [R1206]  73.03 66.92 0 top
R30  4.7kΩ  [R1206]  60.45 66.92 0 top
R31  220Ω  [R1206]  84.07 65.65 270 top
R32  220Ω  [R1206]  68.58 65.65 270 top
R33  220Ω  [R1206]  65.28 65.65 270 top
R34  220Ω  [R1206]  64.96 42.15 90 top
R35  220Ω  [R1206]  69.47 42.15 90 top
R36  220Ω  [R1206]  73.98 42.15 90 top
R37  220Ω  [R1206]  78.49 42.15 90 top
R38  220Ω  [R1206]  60.45 42.15 90 top
R39  47Ω  [R1206]  7.62 43.84 270 top
R40  47Ω  [R1206]  13.55 43.84 270 top
R41  47Ω  [R1206]  19.49 43.84 270 top
R42  47Ω  [R1206]  25.42 43.84 270 top
R43  47Ω  [R1206]  31.35 43.84 270 top
R44  47Ω  [R1206]  37.28 43.84 270 top
R45  47Ω  [R1206]  43.22 43.84 270 top
R46  47Ω  [R1206]  49.15 43.84 270 top
SW1  SS-2235-H2.0  [SW-TH_6P-L9.0-W3.6-P2.50_SS-2235-H2.0]  8.03 15.51 90 top
SW2  SS-2235-H2.0  [SW-TH_6P-L9.0-W3.6-P2.50_SS-2235-H2.0]  18.13 15.51 90 top
SW3  SS-2235-H2.0  [SW-TH_6P-L9.0-W3.6-P2.50_SS-2235-H2.0]  28.24 15.51 90 top
SW4  SS-2235-H2.0  [SW-TH_6P-L9.0-W3.6-P2.50_SS-2235-H2.0]  38.34 15.51 90 top
SW5  SS-2235-H2.0  [SW-TH_6P-L9.0-W3.6-P2.50_SS-2235-H2.0]  48.44 15.51 90 top
SW6  SS-2235-H2.0  [SW-TH_6P-L9.0-W3.6-P2.50_SS-2235-H2.0]  58.54 15.51 90 top
SW7  SS-2235-H2.0  [SW-TH_6P-L9.0-W3.6-P2.50_SS-2235-H2.0]  68.65 15.51 90 top
SW8  SS-2235-H2.0  [SW-TH_6P-L9.0-W3.6-P2.50_SS-2235-H2.0]  78.75 15.51 90 top
SW9  SS-2235-H2.0  [SW-TH_6P-L9.0-W3.6-P2.50_SS-2235-H2.0]  8 31.64 90 top
SW10  SS-2235-H2.0  [SW-TH_6P-L9.0-W3.6-P2.50_SS-2235-H2.0]  18.06 31.64 90 top
SW11  SS-2235-H2.0  [SW-TH_6P-L9.0-W3.6-P2.50_SS-2235-H2.0]  28.11 31.64 90 top
SW12  SS-2235-H2.0  [SW-TH_6P-L9.0-W3.6-P2.50_SS-2235-H2.0]  38.17 31.64 90 top
SW13  SS-2235-H2.0  [SW-TH_6P-L9.0-W3.6-P2.50_SS-2235-H2.0]  48.22 31.64 90 top
SW14  SS-2235-H2.0  [SW-TH_6P-L9.0-W3.6-P2.50_SS-2235-H2.0]  58.28 31.64 90 top
SW15  SS-2235-H2.0  [SW-TH_6P-L9.0-W3.6-P2.50_SS-2235-H2.0]  68.34 31.64 90 top
SW16  SS-2235-H2.0  [SW-TH_6P-L9.0-W3.6-P2.50_SS-2235-H2.0]  78.39 31.64 90 top
SW19  TS110426070  [SW-SMD_TS110426070]  91.06 13.32 270 top
SW20  TS110426070  [SW-SMD_TS110426070]  91.06 24.59 270 top
SW21  TS110426070  [SW-SMD_TS110426070]  91.06 35.85 270 top
SW22  TS110426070  [SW-SMD_TS110426070]  91.06 47.11 270 top
U1  AMS1117-3.3  [SOT-223-3_L6.7-W3.7-P2.30-LS7.0-BR]  13.33 66.67 180 top
U2  TYPEC-250Y-BRP6L68  [TYPE-C-SMD_XUNPU_TYPEC-250Y-BRP6L68]  4.7 61.97 270 top

## Footprints (pads in the part's own frame, mm; a bottom-side part is the same pattern mirrored in y, then rotated)
C0603
  rect 0.8x0.9 smd: 1(-0.7,0) 2(0.7,0)
HDR-TH_3P-P2.54-V-M
  rect 1.7x1.7 hole 1.1: 1(-2.54,0)
  round 1.7 hole 1.1: 2(0,0) 3(2.54,0)
HDR-TH_10P-P2.54-V-M-1
  rect 1.575x1.7 hole 1.1: 1(-11.43,0)
  round 1.7 hole 1.1: 2(-8.89,0) 3(-6.35,0) 4(-3.81,0) 5(-1.27,0) 6(1.27,0) 7(3.81,0) 8(6.35,0) 9(8.89,0) 10(11.43,0)
LED0805-R-RD
  rect 1x1.399 smd: 1(1.05,0) 2(-1.05,0)
LED-SEG-TH_11P-L22.5-W14.0-P2.54-S10.18-BL
  round 1.6 hole 1: 1(-6.35,-5.09) 2(-3.81,-5.09) 3(-1.27,-5.09) 4(1.27,-5.09) 5(3.81,-5.09) 7(6.35,5.09) 8(3.81,5.09) 9(1.27,5.09) 10(-1.27,5.09) 11(-3.81,5.09) 12(-6.35,5.09)
Pad_e130
  round 5 hole 3.2: 1(0,0)
Pad_e132
  round 5 hole 3.2: 1(0,0)
Pad_e133
  round 5 hole 3.2: 2(0,0)
Pad_e134
  round 5 hole 3.2: 3(0,0)
R1206
  rect 1.208x1.701 smd: 1(-1.479,0) 2(1.479,0)
SOT-23-3_L3.0-W1.7-P0.95-LS2.9-BR
  rect 1.038x0.532 smd: 1(1.101,-0.95) 2(1.101,0.95) 3(-1.101,0)
SOT-223-3_L6.7-W3.7-P2.30-LS7.0-BR
  rect 2.34x0.98 smd: 1(2.87,-2.3) 2(2.87,0) 3(2.87,2.3)
  rect 2.34x3.6 smd: 4(-2.87,0)
SW-SMD_TS110426070
  rect 1.5x0.8 smd: 1(-4,2.25) 2(4,2.25) 3(-4,-2.25) 4(4,-2.25)
SW-TH_6P-L9.0-W3.6-P2.50_SS-2235-H2.0
  round 1.5 hole 0.95: 1(-2.5,-1.65) 2(0,-1.65) 3(2.5,-1.65) 4(-2.5,1.65) 5(0,1.65) 6(2.5,1.65)
TYPE-C-SMD_XUNPU_TYPEC-250Y-BRP6L68
  oval 1x1.8 hole 0.6x1.4: 7(-4.32,1.875) 7(-4.32,-1.925) 7(4.32,1.875) 7(4.32,-1.925)
  rect 0.7x1 smd: A5(-0.5,1.925) B5(0.5,1.925)
  rect 0.8x1 smd: A9(1.5,1.925) A12(2.7,1.925) B9(-1.5,1.925) B12(-2.7,1.925)

## Nets
As in the schematic.

Pads without a net: H3 9 10; NOREF 1; NOREF#2 1; NOREF#3 2; NOREF#4 3; SW1 3 6; SW2 3 6; SW3 3 6; SW4 3 6; SW5 3 6; SW6 3 6; SW7 3 6; SW8 3 6; SW9 3 6; SW10 3 6; SW11 3 6; SW12 3 6; SW13 3 6; SW14 3 6; SW15 3 6; SW16 3 6; U2 7

## Via types
v1: diameter 0.61, hole 0.305, Top Layer to Bottom Layer, 17 vias

## Routing (per net, layer and track width the routed paths; a pad name or vN(x,y) marks a point on that pad's centre or on a via; arc(x,y) is an arc through that point)
+3.3V: length 329.8
  Top Layer w0.5: 49.16,42.24 6.27,42.24 3.69,44.82 3.69,45.48 ; 49.16,42.24 51.18,44.25 v1(51.18,44.82) ; 49.16,42.24 49.16,35.69 49.11,35.63 ; 3.69,45.48 3.73,50.33 v1(5.08,51.68) ; 3.69,45.48 3.68,45.47 3.68,23.87 8.05,19.5 13.1,19.5 ; 16.2,70.72 16.32,70.6 v1(18.8,70.6) ; 16.2,70.72 U1.4 U1.2 ; 16.2,70.72 C5.2 ; Q3.3 76.88,63.46 72.01,58.6 72.01,57.01 71.12,56.12 68.45,56.12 ; 68.45,56.12 v1(59.82,56.12) 58.59,57.35 Q1.3 ; 68.45,56.12 69.54,57.21 69.54,61.87 Q2.3
  Top Layer w0.8: R27.2 R26.2 R25.2 R24.2 R23.2 R22.2 R21.2 R20.2 ; 83.82,19.5 13.1,19.5
  Bottom Layer w0.5: v1(18.8,70.6) 18.8,65.39 v1(5.08,51.68) ; v1(59.82,56.12) 59.82,53.46 v1(51.18,44.82)
+5V: length 192.4
  Top Layer w0.5: 18.3,63.82 18.3,67.78 R3.2
  Top Layer w0.8: U2.A9 5.31,60.47 4.06,61.71 4.06,62.21 5.32,63.47 U2.B9 7.11,63.47 7.36,63.72 9.19,63.72 9.83,64.36 11.23,64.36 11.77,63.82 18.3,63.82 19.52,62.6 22.61,62.6 31.97,71.96 31.97,77.49 ; 31.97,77.49 32.32,77.84 33.01,77.84 33.02,77.85 57.48,77.85 57.48,77.84 59.15,77.84 59.65,77.34 59.65,71.36 47.97,59.67 47.97,58.54 52.16,54.35 93.93,54.35 95.96,56.38 H6.2 ; 31.97,77.49 31.46,76.98 9.94,76.98 9.14,76.18 9.14,73.31 9.94,72.51 11.37,72.51 C4.2
  Bottom Layer w0.5: H5.2 94.36,64.38 94.36,58.28 H6.2
GND: length 6.6
  Top Layer w0.8: R2.1 R1.1 ; 11.43,73.97 14.35,73.97
DP: length 52.7
  Top Layer w0.5: 60.45,40.55 54.31,40.55 52.32,42.53 52.32,49.61 42.67,59.26 42.67,60.45 55.61,73.39 55.61,74.42 54.36,75.67 H1.9
SERVO1: length 18
  Top Layer w0.5: H5.1 96.01,69.08 88.01,69.08 85.34,71.75 82.8,71.75 80.65,73.9 H3.8
SERVO2: length 27.2
  Top Layer w0.5: H6.1 91.31,58.92 87.22,63.01 87.22,67.45 84.71,69.97 81.79,69.97 H3.7
W1: length 83.8
  Top Layer w0.5: SW9.5 8.13,33.42 8.13,37.58 11.05,40.5 35.88,40.5 v1(36.07,40.69)
  Top Layer w0.8: SW9.5 SW9.2 12.01,31.64 R20.1
  Bottom Layer w0.5: H2.9 54.36,71.24 36.07,52.95 v1(36.07,40.69)
W2: length 77.6
  Top Layer w0.5: v1(36.58,38.98) 18.42,38.98 v1(18.29,38.85)
  Top Layer w0.8: R21.1 22.07,31.64 SW10.2 SW10.5
  Bottom Layer w0.5: v1(18.29,38.85) 18.03,38.6 18.03,33.27 SW10.5 ; v1(36.58,38.98) 38.23,40.63 38.23,52.06 57.53,71.36 57.53,73.65 57.28,73.9 H2.10
$1N489: length 9.8
  Top Layer w0.5: R1.2 12.41,62.47 U2.A5
$1N494: length 5.7
  Top Layer w0.5: R2.2 9.73,61.47 U2.B5
$1N1457: length 3.2
  Top Layer w0.5: R3.1 23.07,66.96 LED1.1
$1N2239: length 2.4
  Top Layer w0.5: R39.1 7.63,45.33 LED2.1
$1N2499: length 2.4
  Top Layer w0.5: LED4.1 19.5,45.33 R41.1
$1N2504: length 2.4
  Top Layer w0.5: LED5.1 25.43,45.33 R42.1
$1N2509: length 2.4
  Top Layer w0.5: R43.1 31.37,45.33 LED6.1
$1N2522: length 2.4
  Top Layer w0.5: LED7.1 37.3,45.33 R44.1
$1N2526: length 2.4
  Top Layer w0.5: LED8.1 43.23,45.33 R45.1
$1N2531: length 2.4
  Top Layer w0.5: LED9.1 49.16,45.33 R46.1
$1N2539: length 41.2
  Top Layer w0.5: H1.1 34.04,76.11 35.23,74.92 35.23,72.89 15.67,53.33 11.12,53.33 LED2.2
$1N2545: length 37.8
  Top Layer w0.5: LED3.2 14.07,50.34 15.18,50.34 37.83,73 37.83,74.42 36.58,75.67 H1.2
$1N2552: length 35.8
  Top Layer w0.5: LED4.2 19.5,52.52 40.37,73.39 40.37,74.42 39.12,75.67 H1.3
$1N2568: length 34.4
  Top Layer w0.5: LED5.2 25.43,55.91 42.91,73.39 42.91,74.42 41.66,75.67 H1.4
$1N2577: length 33
  Top Layer w0.5: LED6.2 31.37,59.3 44.2,72.13 44.2,72.13 45.45,73.39 45.45,74.42 44.2,75.67 H1.5
$1N2586: length 33.1
  Top Layer w0.5: LED7.2 37.3,57.31 35.4,59.2 35.4,60.8 47.99,73.39 47.99,74.42 47.98,74.43 47.98,74.47 46.72,75.73 46.72,76.43 H1.6
$1N2592: length 34.8
  Top Layer w0.5: H1.7 49.28,75.67 50.53,74.42 50.53,73.23 37.58,60.28 37.58,59.57 43.23,53.91 LED8.2
$1N2600: length 36.4
  Top Layer w0.5: H1.8 51.82,75.67 53.07,74.42 53.07,73.39 39.91,60.23 39.91,59.52 49.16,50.27 LED9.2
$1N3515: length 80.8
  Top Layer w0.8: R12.1 12.06,15.51 SW1.2
  Bottom Layer w0.5: SW1.5 6,15.51 2.03,19.48 2.03,38.72 33.66,70.35 33.66,73.52 H2.1
  Bottom Layer w0.8: SW1.5 SW1.2
$1N3939: length 86.7
  Top Layer w0.8: R13.1 22.17,15.51 SW2.2
  Bottom Layer w0.5: SW2.5 10.03,21.96 6.22,21.96 3.68,24.5 3.68,37.71 36.58,70.6 H2.2
  Bottom Layer w0.8: SW2.5 SW2.2
$1N3994: length 85.9
  Top Layer w0.8: SW3.2 32.27,15.51 R14.1
  Bottom Layer w0.5: H2.3 39.12,70.73 12.19,43.81 12.19,24.37 15.62,20.94 21.15,20.94 SW3.5
  Bottom Layer w0.8: SW3.5 SW3.2
$1N4049: length 94.2
  Top Layer w0.8: SW4.2 42.37,15.51 R15.1
  Bottom Layer w0.5: H2.4 42.16,73.4 42.16,71.62 13.97,43.42 13.97,25.64 17.65,21.96 22.61,21.96 23.62,20.94 31.25,20.94 SW4.5
  Bottom Layer w0.8: SW4.5 SW4.2
$1N4294: length 102
  Top Layer w0.8: R17.1 62.58,15.51 60.19,15.51
  Bottom Layer w0.5: H2.6 46.74,71.11 23.88,48.25 23.88,25.77 27.18,22.47 49.93,22.47 SW6.5
  Bottom Layer w0.8: SW6.5 60.19,15.51
$1N4304: length 94.4
  Top Layer w0.8: R16.1 52.48,15.51 SW5.2
  Bottom Layer w0.5: SW5.5 46.41,15.51 40.21,21.71 24.26,21.71 22.22,23.74 22.22,49.01 44.07,70.86 44.07,73.78 H2.5
  Bottom Layer w0.8: SW5.5 SW5.2
$1N4310: length 100.8
  Top Layer w0.8: SW7.2 72.68,15.51 R18.1
  Bottom Layer w0.5: H2.7 49.4,73.78 49.4,71.24 32.26,54.09 32.26,26.91 36.07,23.1 58.42,23.1 66.01,15.51 SW7.5
  Bottom Layer w0.8: SW7.5 SW7.2
$1N4316: length 109.7
  Top Layer w0.8: R19.1 82.78,15.51 SW8.2
  Bottom Layer w0.5: SW8.5 76.14,15.51 71.34,20.31 63.88,20.31 58.67,25.52 34.8,25.52 34.16,26.15 34.16,53.4 51.53,70.77 51.53,73.87 51.56,73.9 H2.8
  Bottom Layer w0.8: SW8.5 SW8.2
$1N5605: length 62
  Top Layer w0.8: R23.1 42.18,31.64 SW12.2 SW12.5
  Bottom Layer w0.5: H3.2 65.15,73.35 41.91,50.11 41.91,48.97 41.56,48.63 41.56,39.65 38.99,37.07 38.99,34.94 38.67,34.61 38.67,33.66 38.99,33.34 38.99,33.22 37.41,31.64 36.52,31.64
$1N5629: length 69.2
  Top Layer w0.5: v1(28.57,37.33) v1(36.32,37.33)
  Top Layer w0.8: R22.1 32.12,31.64 SW11.2 SW11.5
  Bottom Layer w0.5: v1(28.57,37.33) 28.57,33.75 SW11.5 ; v1(36.32,37.33) 36.7,37.33 38.86,39.49 38.86,50.35 62.16,73.65 62.36,73.65 H3.1
$1N6803: length 5.3
  Top Layer w0.5: Q1.1 60.66,62.54 60.66,62.96 59.35,64.28 59.35,66.42 58.97,66.79 R30.1
$1N6820: length 5.1
  Top Layer w0.5: Q2.1 73.36,63.09 72.14,64.31 72.14,66.33 R29.1
$1N6826: length 5.1
  Top Layer w0.5: R28.1 77.98,66.33 77.98,63.64 Q3.1
$1N6838: length 7.5
  Top Layer w0.5: LED10.12 63.12,62.6 61.41,64.31 Q1.2
$1N6844: length 9.7
  Top Layer w0.5: Q2.2 74.42,63.38 74.42,62.22 73.41,61.2 70.99,61.2 70.64,60.85 70.64,58.27 LED10.9
$1N6850: length 11.8
  Top Layer w0.5: LED10.8 76.44,61.33 79.88,61.33 80.39,61.84 80.39,63.13 Q3.2
$1N6855: length 10.2
  Top Layer w0.5: R30.2 61.42,67.43 61.42,74.92 62.61,76.11 H4.10
$1N6860: length 12.7
  Top Layer w0.5: H4.7 68.98,75.19 68.98,71.76 73.7,67.05 74.38,67.05 R29.2
$1N6868: length 16.2
  Top Layer w0.5: H4.6 72.64,76.32 72.64,75.56 71.48,74.39 71.48,71.52 73.54,69.46 77.47,69.46 80.01,66.92 R28.2
$1N6873: length 17
  Top Layer w0.5: R31.1 82.16,67.13 78.05,71.24 74.8,71.24 74.06,71.98 74.06,74.42 75.31,75.67 H4.5
$1N6882: length 10.7
  Top Layer w0.5: R32.1 67.69,68.02 67.69,72.13 66.44,73.39 66.44,74.42 67.69,75.67 H4.8
$1N6894: length 45.7
  Top Layer w0.5: 64.96,40.55 67.31,42.9 v1(67.31,46.6)
  Bottom Layer w0.5: H4.4 76.6,75.19 76.6,61.57 77.1,61.07 77.1,49.4 74.42,46.73 67.44,46.73 v1(67.31,46.6)
$1N6900: length 42.3
  Top Layer w0.5: v1(71.63,45.33) 71.63,42.71 69.47,40.55
  Bottom Layer w0.5: v1(71.63,45.33) 74.8,45.33 79.14,49.67 79.14,75.19 H4.3
$1N6943: length 39.5
  Top Layer w0.5: R36.1 73.98,41.37 76.58,43.98 v1(76.58,44.69)
  Bottom Layer w0.5: v1(76.58,44.69) 81.66,49.77 81.66,75.17 82.93,76.44
$1N7039: length 38.8
  Top Layer w0.5: v1(80.77,45.2) 80.77,42.83 78.49,40.55
  Bottom Layer w0.5: H4.1 84.18,75.16 84.18,48.61 v1(80.77,45.2)
$1N8645: length 8.6
  Top Layer w0.5: 78.49,43.51 78.49,46.09 76.59,47.99 LED10.5
$1N8653: length 11.1
  Top Layer w0.5: LED10.7 78.75,58.17 84.07,63.49 R31.2
$1N8661: length 6.2
  Top Layer w0.5: R32.2 68.58,58.55 68.2,58.17
$1N8736: length 6.2
  Top Layer w0.5: LED10.11 65.66,63.79 R33.2
$1N8986: length 6
  Top Layer w0.5: 60.45,43.51 60.45,46.09 62.35,47.99 LED10.1
$1N9010: length 4.8
  Top Layer w0.5: 64.96,43.51 64.96,46.28 65.66,46.98 LED10.2
$1N9014: length 5
  Top Layer w0.5: 68.2,47.99 69.47,46.72 69.47,43.51
$1N9048: length 5.7
  Top Layer w0.5: 73.28,43.63 73.28,45.96 71.26,47.99 LED10.4
$1N9241: length 110.4
  Top Layer w0.5: SW19.4 SW19.3 90.68,19.19 90.68,19.29 92.2,20.82 92.2,22.22 90.68,23.74 90.68,28.95 89.56,30.06 86.05,30.06 R27.1
  Top Layer w0.8: SW16.5 SW16.2 82.4,31.64 R27.1
  Bottom Layer w0.5: SW16.5 69.91,38.47 55.12,38.47 49.53,44.06 49.53,47.61 75.31,73.4 H3.6
$1N9260: length 106.2
  Top Layer w0.5: R26.1 74.17,31.89 74.17,21.58 74.52,21.23 88.17,21.23 SW20.4 SW20.3
  Top Layer w0.8: R26.1 72.35,31.64 SW15.2 SW15.5
  Bottom Layer w0.5: H3.5 72.77,73.52 47.88,48.63 47.88,43.3 54.48,36.69 61.63,36.69 SW15.5
$1N9265: length 119.5
  Top Layer w0.5: v1(91.95,25.77) 91.95,30.34 90.44,31.85 SW21.4 SW21.3 ; R25.1 63.33,23.78 64.39,22.72 v1(70.87,22.72)
  Top Layer w0.8: R25.1 62.29,31.64 SW14.2 SW14.5
  Bottom Layer w0.5: H3.4 70.23,73.52 45.85,49.14 45.85,42.42 SW14.5 ; v1(91.95,25.77) 90.55,24.37 72.52,24.37 v1(70.87,22.72)
$1N9299: length 130.4
  Top Layer w0.5: v1(61.59,24.25) 57.91,24.25 53.27,28.89 R24.1 ; SW22.3 SW22.4 91.31,40.6 v1(91.31,38.09)
  Top Layer w0.8: SW13.5 SW13.2 52.24,31.64 R24.1
  Bottom Layer w0.5: SW13.5 46.45,31.64 42.29,35.79 42.29,48.12 67.69,73.52 H3.3 ; v1(91.31,38.09) 91.31,29.45 87.76,25.9 63.25,25.9 v1(61.59,24.25)
$1N11687: length 10.4
  Top Layer w0.5: H4.9 65.15,75.67 63.9,74.42 63.9,73.39 65.15,72.13 65.15,67.25 R33.1
$1N12459: length 2.4
  Top Layer w0.5: R40.1 13.57,45.33 LED3.1

## Copper pours and planes (outline as drawn; the poured copper is in the pictures)
GND on Top Layer: -4.44,85.97 102.11,85.97 102.11,-7.38 -4.44,-7.38
GND on Bottom Layer: -2.79,83.17 103.63,83.17 103.63,-2.93 -2.79,-2.93

## Text on the board
Top Silkscreen Layer: A3 | A2 | A1 | A0 | A7 | B7 | A6 | B6 | A5 | B5 | A4 | B4 | B3 | B2 | B1 | B0 | 5 | 4 | 2 | 1 | 6 | 3 | 0 | 7 | S | 5V | GND | L5 | L4 | L3 | L2 | L1 | L0 | DE | DF | D2 | D3 | DB | DD | S1 | S2 | DP | DC | DG | L7 | L6 | D1 | DA | SG90_1 | SG90_2 | FPGA LAB V1
